# Altium schematic sheet Dogfish3D - Driver Channel.SchDoc
size A
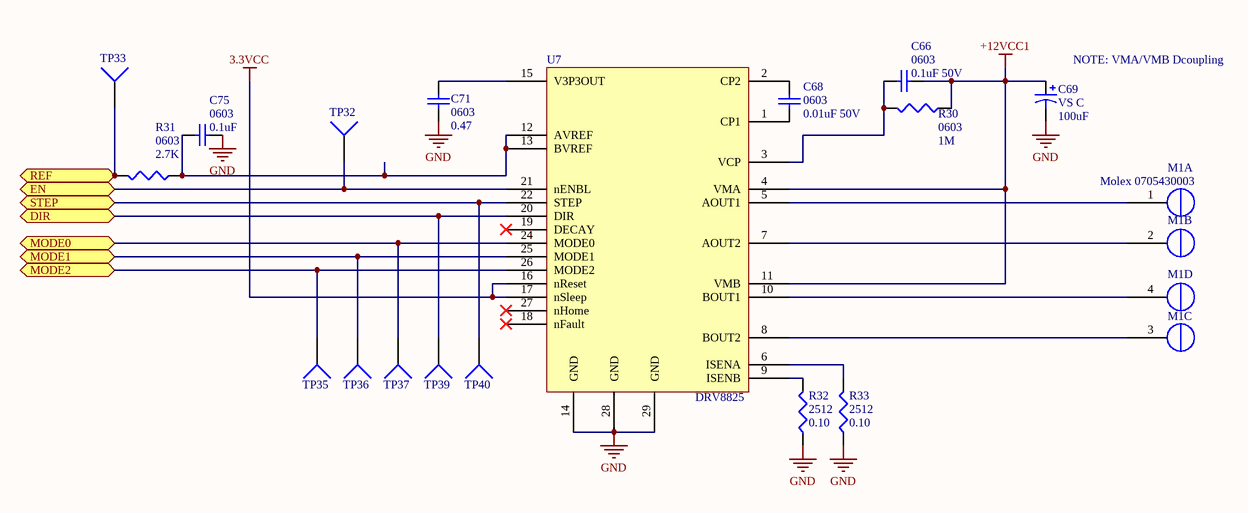
[diagram p0: Dogfish3D - Driver Channel.SchDoc]

## Parts
C66  0603  value 0.1uF 50V  [1608[0603]]
C68  0603  value 0.01uF 50V  [1608[0603]]
C69  VS C  value 100uF  [Panasonic VS C]
C71  0603  value 0.47  [1608[0603]]
C75  0603  value 0.1uF  [1608[0603]]
M1  Molex 0705430003  [4POL254]  (parts A,B,C,D of 4)
R30  0603  value 1M  [J1-0603]
R31  0603  value 2.7K  [J1-0603]
R32  2512  value 0.10  [Resistor2512]
R33  2512  value 0.10  [Resistor2512]
TP32  TP4  [TP-2]  (value not drawn)
TP33  TP4  [TP-2]  (value not drawn)
TP35  TP4  [TP-2]  (value not drawn)
TP36  TP4  [TP-2]  (value not drawn)
TP37  TP4  [TP-2]  (value not drawn)
TP39  TP4  [TP-2]  (value not drawn)
TP40  TP4  [TP-2]  (value not drawn)
U7  DRV8825  [DRV8825]

## Ports
DIR, EN, MODE0, MODE1, MODE2, REF, STEP

## Nets
3.3VCC: U7.16(nReset) U7.17(nSleep)
+12VCC1: C66.1 C69.1 R30.1 U7.4(VMA) U7.11(VMB)
GND: C69.2 C71.1 C75.1 R32.1 R33.1 U7.14(GND) U7.28(GND) U7.29(GND)
DIR: TP39.1 U7.20(DIR) ; port DIR
EN: TP32.1 U7.21(nENBL) ; port EN
MODE0: TP37.1 U7.24(MODE0) ; port MODE0
MODE1: TP36.1 U7.25(MODE1) ; port MODE1
MODE2: TP35.1 U7.26(MODE2) ; port MODE2
REF: R31.2 TP33.1 ; port REF
STEP: TP40.1 U7.22(STEP) ; port STEP
NetC66_2: C66.2 R30.2 U7.3(VCP)
NetC68_1: C68.1 U7.1(CP1)
NetC68_2: C68.2 U7.2(CP2)
NetC71_2: C71.2 U7.15(V3P3OUT)
NetC75_2: C75.2 R31.1 U7.12(AVREF) U7.13(BVREF)
NetM1_1: M1.1(OUT2B) U7.5(AOUT1)
NetM1_2: M1.2(OUT2A) U7.7(AOUT2)
NetM1_3: M1.3(OUT1A) U7.8(BOUT2)
NetM1_4: M1.4(OUT1B) U7.10(BOUT1)
NetR32_2: R32.2 U7.9(ISENB)
NetR33_2: R33.2 U7.6(ISENA)

Not connected (* = marked no-connect by the designer): U7 18(nFault)* 19(DECAY)* 23(NC) 27(nHome)*

## Notes on the sheet
- (near C69) NOTE: VMA/VMB Dcoupling

## Library data of the parts
C66 C68 C71 C75 = Cap Semi: Capacitor (Semiconductor SIM Model); Published: 8-Jun-2000; LatestRevisionDate: 29-May-2009; LatestRevisionNote: IPC-7351 Footprint Added.; PackageReference: C1206; Publisher: Altium Limited; PackageDescription: Chip Capacitor
C69 = Cap Pol1: Polarized Capacitor (Radial); Published: 8-Jun-2000; LatestRevisionDate: 17-Jul-2002; LatestRevisionNote: Re-released for DXP Platform.; PackageReference: RB7.6-15; Publisher: Altium Limited; PackageDescription: Polarized Capacitor (Radial); 2 Leads
M1 = Molex 0705430003 Alt: Molex 4 Pin Clip Connector
R30-R33 = Res3: Resistor; Published: 8-Jun-2000; LatestRevisionDate: 29-May-2009; LatestRevisionNote: IPC-7351 Footprint Added.; PackageReference: J1-0603; Publisher: Altium Limited; PackageDescription: Chip Resistor
TP32 TP33 TP35-TP37 TP39 TP40 = Socket: LatestRevisionDate: 17-Jul-2002; LatestRevisionNote: Re-released for DXP Platform.; Publisher: Altium Limited
U7 = DRV8825: DRV8825 Ti Stepper Driver